# EAGLE design AOA_base_interconnect (EAGLE 4.16)
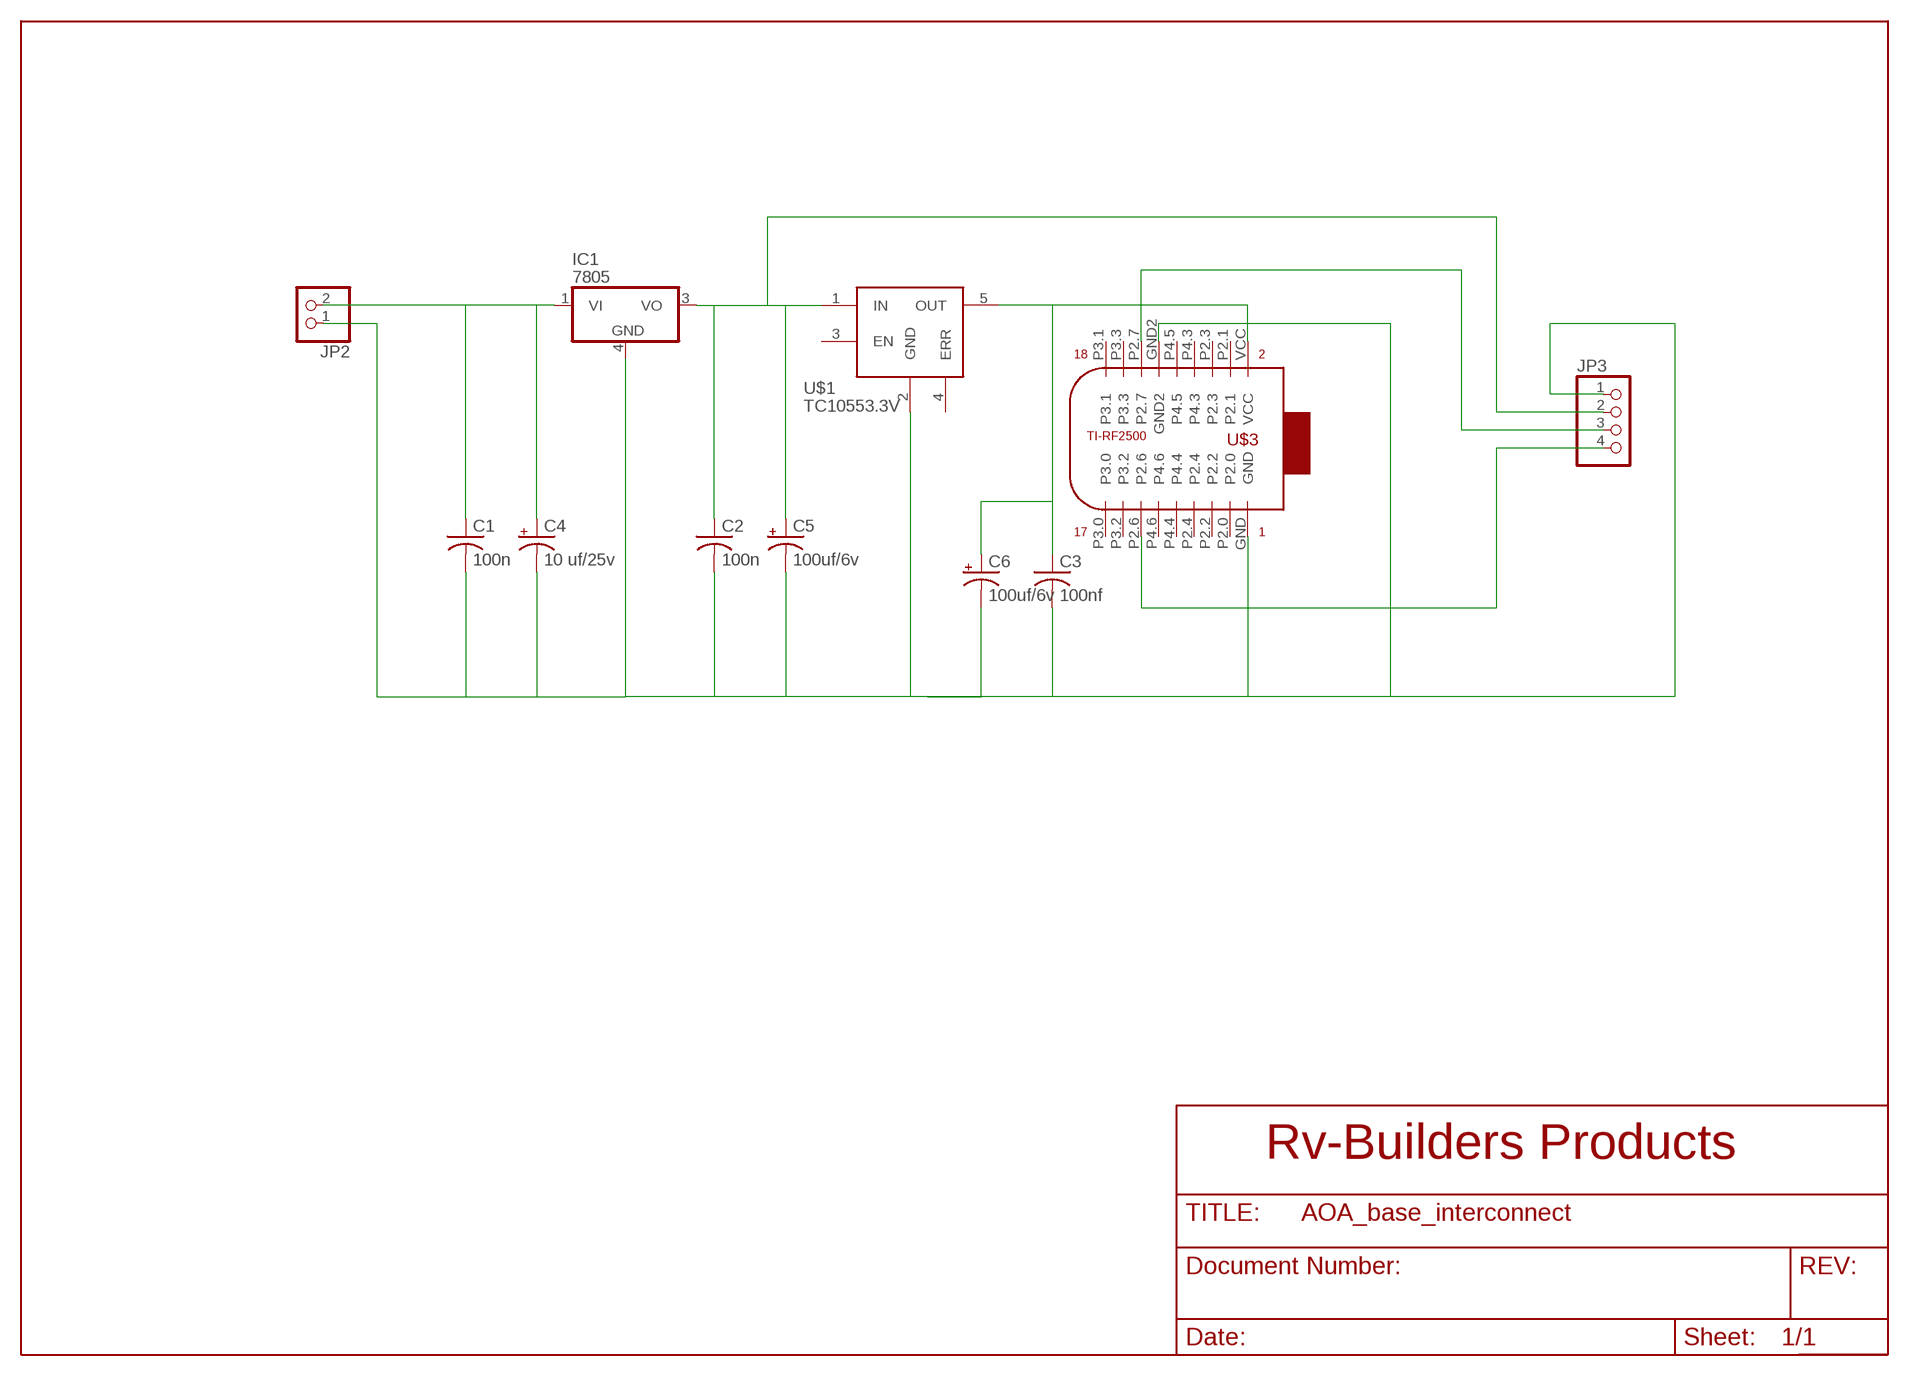
[diagram p0: schematic, sheet 1]

## Parts
C1  100n  C-USC0805  [C0805]
C2  100n  C-USC0805  [C0805]
C3  100nf  C-USC0805  [C0805]
C4  10 uf/25v  CPOL-USSMCD  [SMC_D]
C5  100uf/6v  CPOL-USSMCC  [SMC_C]
C6  100uf/6v  CPOL-USSMCB  [SMC_B]
IC1  7805  78MXXL  [DPACK]
JP2  PINHD-1X2  [1X02]
JP3  PINHD-1X4  [1X04]
U$1  TC10553.3V  [SOT23-5]
U$3  TI_RF2500  [TI-RF2500]

## Nets
N$1: C1.2 C2.2 C3.2 C4.- C5.- C6.- IC1.4(GND) JP2.1 JP3.1 U$1.2(GND) U$3.GND U$3.GND2
N$2: C1.1 C4.+ IC1.1(VI) JP2.2
N$4: C2.1 C5.+ IC1.3(VO) JP3.2 U$1.1(IN)
N$8: C3.1 C6.+ U$1.5(OUT) U$3.VCC
SCK: JP3.4 U$3.P2.6
SDA: JP3.3 U$3.P2.7
Unconnected: U$1.3(EN) U$1.4(ERR) U$3.P2.0 U$3.P2.1 U$3.P2.2 U$3.P2.3 U$3.P2.4 U$3.P3.0 U$3.P3.1 U$3.P3.2 U$3.P3.3 U$3.P4.3 U$3.P4.4 U$3.P4.5 U$3.P4.6

## Library data of the parts
C1-C3 = rcl:C-US: CAPACITOR, American symbol
C4-C6 = rcl:CPOL-US: POLARIZED CAPACITOR, American symbol
IC1 = Stofer:78MXXL: VOLTAGE REGULATOR
JP2 = Headers:PINHD-1X2: PIN HEADER
JP3 = Headers:PINHD-1X4: PIN HEADER
U$1 = Stofer:TC10553.3V
U$3 = PCB-Outlines:TI_RF2500

## Board
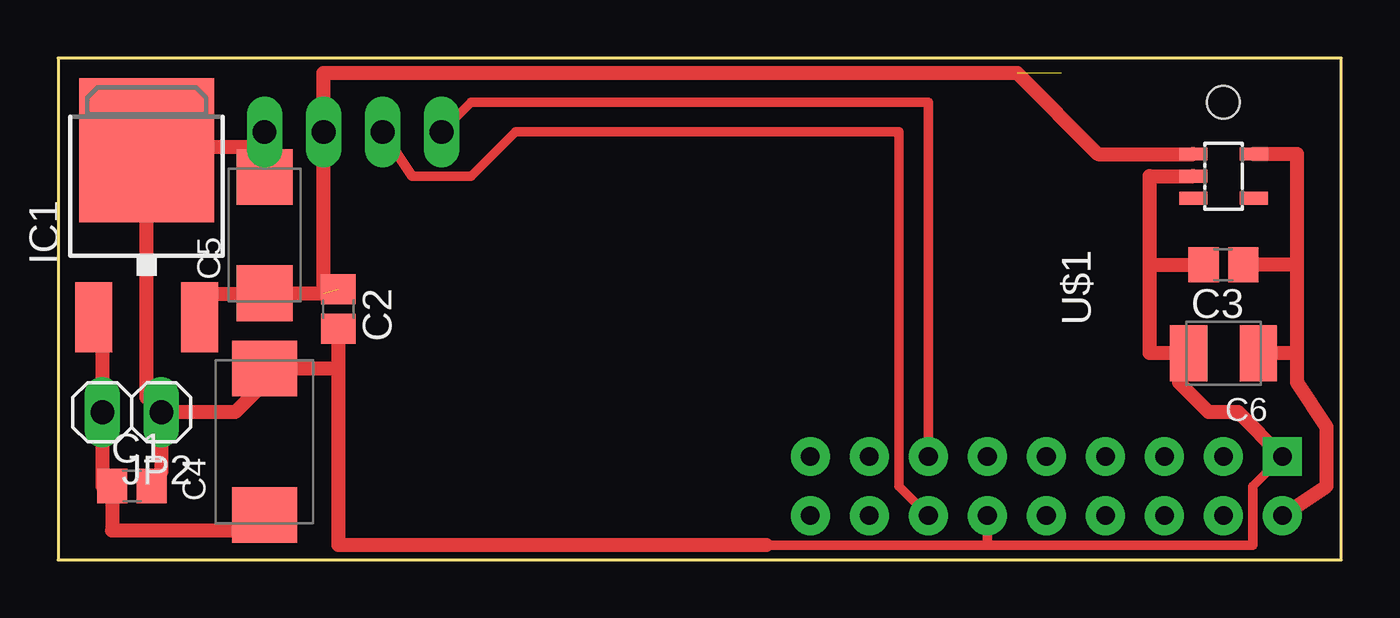
[diagram p1: board, top side]
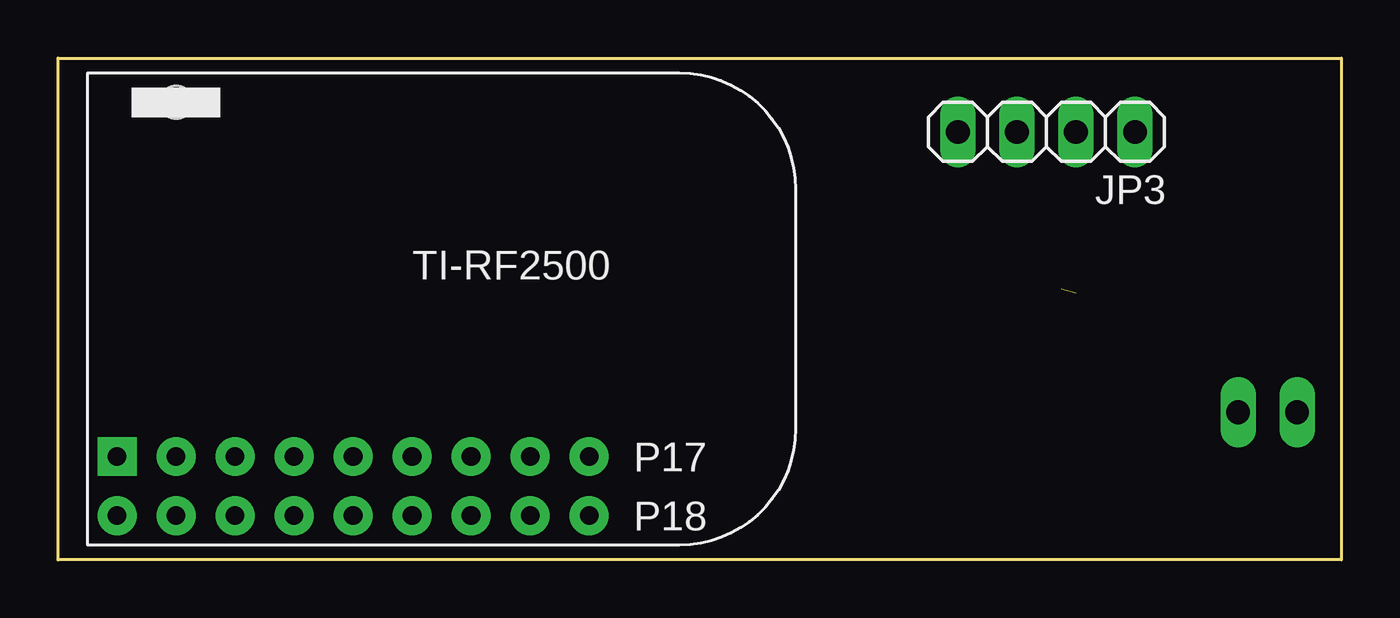
[diagram p2: board, bottom side, seen from below]

Size 55.24 x 21.59 mm. Coordinates in mm from the lower left corner, seen from the top.
Outline: 55.24,0 55.24,21.59 0,21.59 0,0 55.24,0
Copper layers (1*2+15*16): Top 0.035mm / dielectric 0.2mm / Route2 0.035mm / dielectric 0.15mm / Route15 0.035mm / dielectric 0.2mm / Bottom 0.035mm
Design rules "default": minimum track width 10mil, minimum drill 24mil, track to track 8mil, track to pad 8mil, pad to pad 8mil, via to via 8mil, smd to smd 8mil, copper to edge 40mil, drill to drill 8mil, minimum pad ring 10mil, minimum via ring 8mil, stop-mask expansion 4mil, vias tented up to drill 0mil, thermal gap 10mil

### Footprints (pad centres in the part's own frame; a part is rotated, then mirrored left to right if it is on the bottom)
C0805 = smd 1.3 x 1.5: 1 -0.85,0; 2 0.85,0
SMC_D = smd 2.4 x 2.8: + -3.15,0; - 3.15,0
SMC_C = smd 2.4 x 2.4: + -2.5,0; - 2.5,0
SMC_B = smd 1.6 x 2.4: + -1.5,0; - 1.5,0
DPACK = smd 1.6 x 3: 1 -2.28,-4.8; 3 2.28,-4.8 | smd 5.8 x 6.2: 4 0,2.38
1X02 = drill 1.016 long: 1 -1.27,0; 2 1.27,0
1X04 = drill 1.016 long: 1 -3.81,0; 2 -1.27,0; 3 1.27,0; 4 3.81,0
SOT23-5 = smd 0.55 x 1.2: 1 -0.95,-1.3; 2 0,-1.3; 3 0.95,-1.3; 4 0.95,1.3; 5 -0.95,1.3
TI-RF2500 = drill 0.8 pad 1.676 square: GND 1.27,3.81 | drill 0.8 pad 1.676 round: GND2 13.97,1.27; P2.0 3.81,3.81; P2.1 3.81,1.27; P2.2 6.35,3.81; P2.3 6.35,1.27; P2.4 8.89,3.81; P2.6 16.51,3.81; P2.7 16.51,1.27; P3.0 21.59,3.81; P3.1 21.59,1.27; P3.2 19.05,3.81; P3.3 19.05,1.27; P4.3 8.89,1.27; P4.4 11.43,3.81; P4.5 11.43,1.27; P4.6 13.97,3.81; VCC 1.27,1.27 | hole 1.4: 3.81,19.05

### Placement (x,y rotation side)
C1  3.18,3.17 0 top
C2  12.06,10.79 270 top
C3  50.16,12.7 180 top
C4  8.89,5.08 90 top
C5  8.89,13.97 90 top
C6  50.16,8.89 180 top
IC1  3.81,15.24 0 top
JP2  3.18,6.35 180 top
JP3  12.7,18.41 180 bottom
U$1  50.16,16.51 270 top
U$3  53.98,0.64 0 bottom

### Tracks (layer width: path | path; a pad name or v marks a point on that pad's centre or on a via)
N$1
  Top 0.406: 8.89,8.26 C4.- 8.89,7.62 | IC1.4 3.81,17.78 | 8.89,17.78 C5.- | C2.2 12.06,10.16 | U$3.GND2 40,0.64 | U$3.GND 51.44,3.17 51.44,0.64 40,0.64 | C1.2 3.81,3.17 4.45,3.81 | 40,0.64 30.48,0.64 | 48.26,8.26 C6.- 48.26,8.89 48.26,8.26
  Top 0.61: C5.- JP3.1 | 3.81,17.78 8.89,17.78 | 12.06,8.23 C4.- | C2.2 12.06,8.23 | 12.06,8.23 12.06,0.64 30.48,0.64 | U$1.2 46.99,16.51 46.99,12.7 | 46.99,12.7 C3.2 | 46.99,12.7 46.99,8.89 48.26,8.89 48.26,7.62 49.53,6.35 50.8,6.35 U$3.GND | IC1.4 3.81,6.99 JP2.1 | JP2.1 4.45,3.81 | JP2.1 7.62,6.35 8.89,7.62
N$2
  Top 0.406: 1.53,10.16 1.27,10.16 | IC1.1 1.53,10.16 | 1.53,10.16 1.91,10.16 | 1.91,3.17 C1.1 | 8.89,1.27 C4.+
  Top 0.61: 1.91,10.16 JP2.2 1.91,3.17 | C1.1 2.32,1.27 8.89,1.27
N$4  (2 unrouted)
  Top 0.406: C5.+ 8.89,11.43 | 6.09,11.43 IC1.3
  Top 0.61: 8.89,11.43 6.09,11.43 | C5.+ 11.43,11.47 JP3.2 11.43,20.95 41.27,20.95 44.77,17.46 U$1.1
N$8
  Top 0.406: C6.+ 51.44,8.26 | 53.34,16.51 53.34,17.14
  Top 0.61: U$3.VCC 54.61,3.17 54.61,5.71 53.34,7.62 53.34,8.89 | 53.34,12.7 53.34,16.51 53.34,17.46 U$1.5 | 53.34,12.7 C3.1 | 53.34,8.89 53.34,12.7 | 53.34,8.89 C6.+
SCK
  Top 0.406: 37.47,17.14 U$3.P2.6 | 37.47,17.14 37.47,18.41 | JP3.4 17.78,19.68 37.47,19.68 37.47,17.14
SDA
  Top 0.406: U$3.P2.7 36.2,3.17 36.2,18.41 19.68,18.41 17.78,16.51 15.24,16.51 JP3.3